# EAGLE design ENC_1_1 (EAGLE 7.6.0)
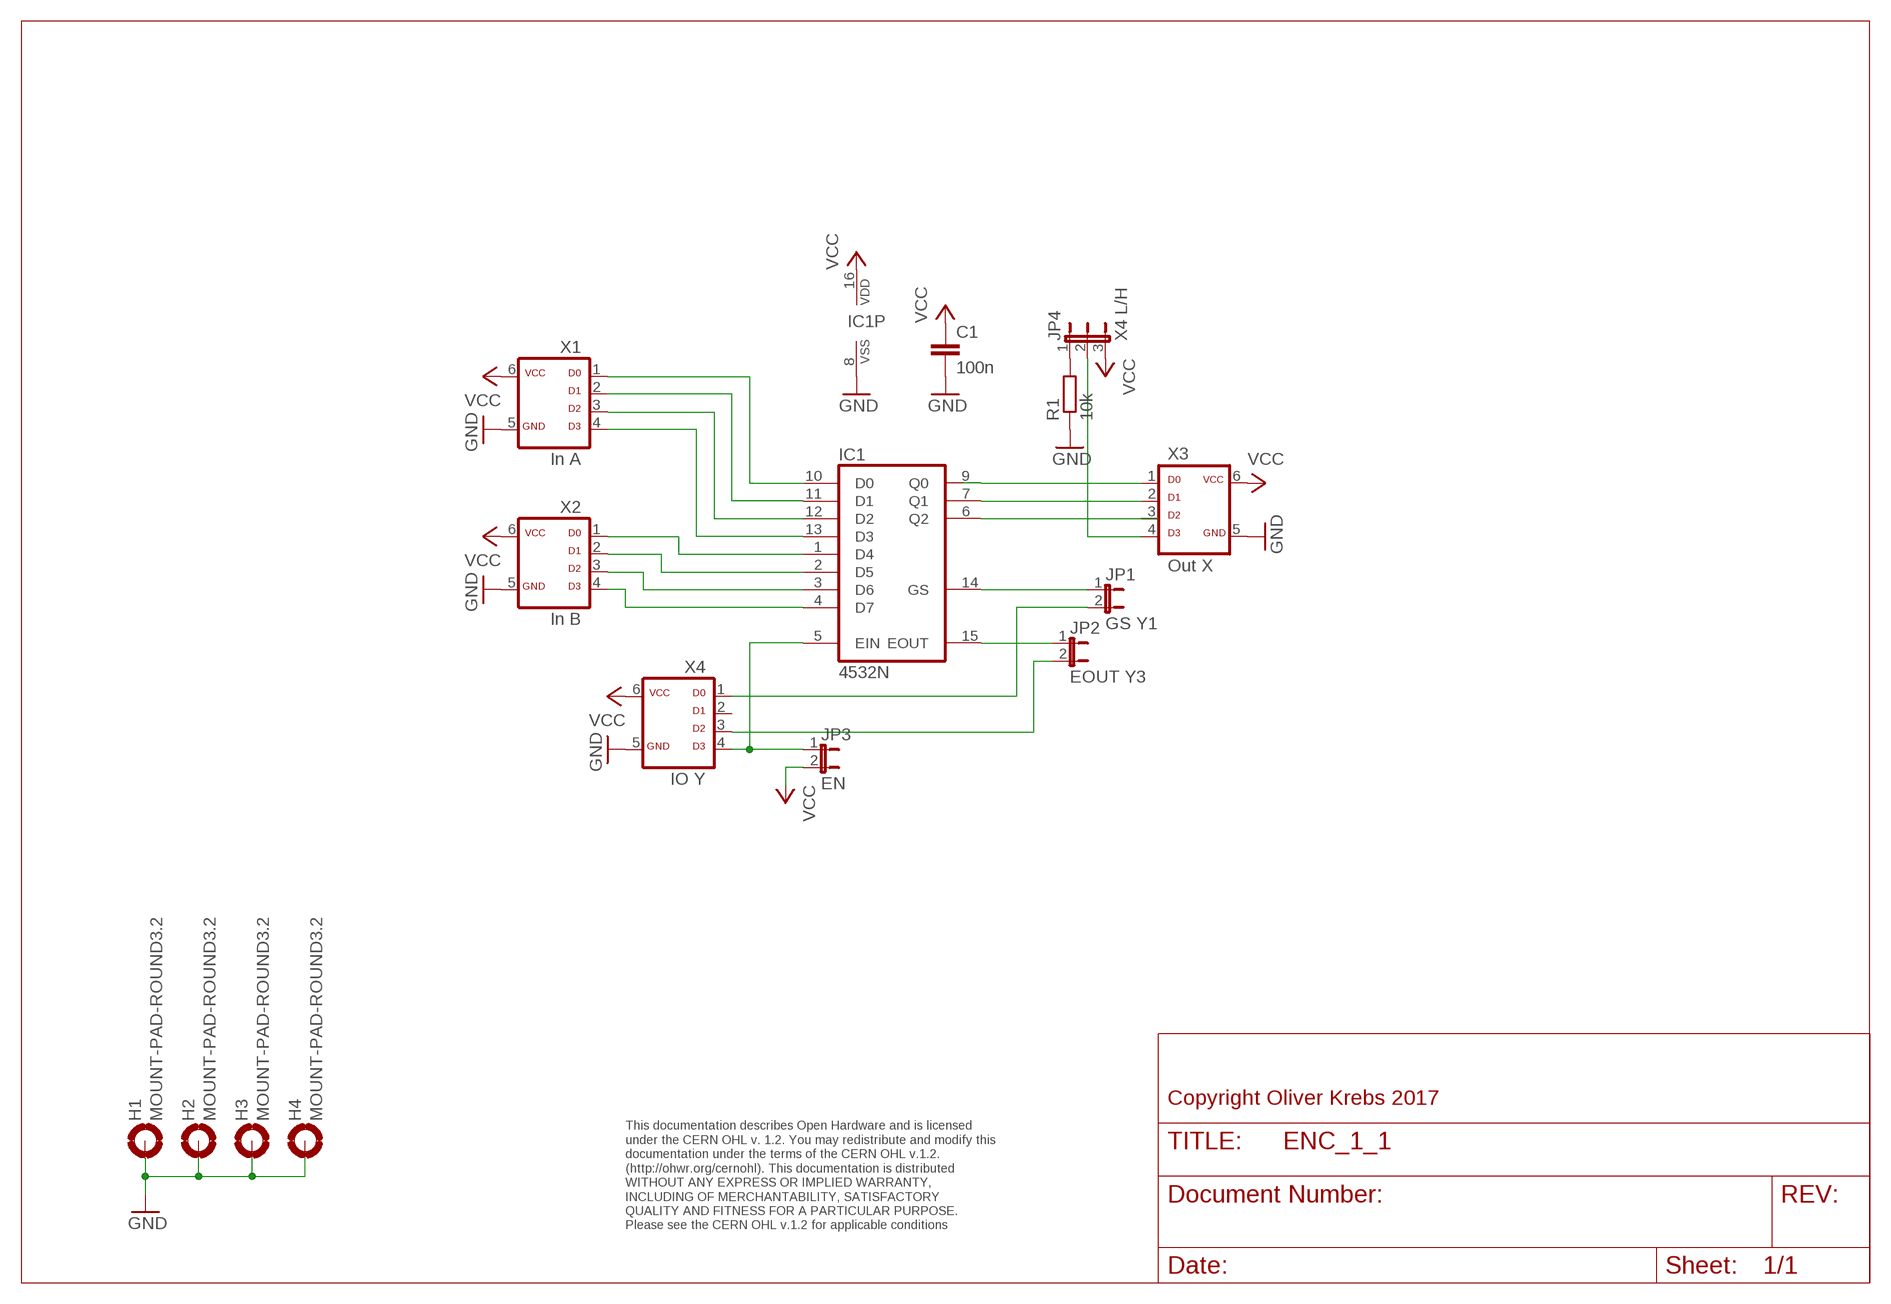
[diagram p0: schematic, sheet 1]

## Parts
C1  100n  C-EU050-025X075  [C050-025X075]
H1  MOUNT-PAD-ROUND3.2  [3,2-PAD]
H2  MOUNT-PAD-ROUND3.2  [3,2-PAD]
H3  MOUNT-PAD-ROUND3.2  [3,2-PAD]
H4  MOUNT-PAD-ROUND3.2  [3,2-PAD]
IC1  4532N  [DIL16]
JP1  GS Y1  JP1E  [JP1]
JP2  EOUT Y3  JP1E  [JP1]
JP3  EN  JP1E  [JP1]
JP4  X4 L/H  JP2EJP2-U  [JP2-U]
R1  10k  R-EU_0207/10  [0207/10]
X1  In A  ML6D  [ML-6]
X2  In B  ML6D  [ML-6]
X3  Out X  ML6D  [ML-6]
X4  IO Y  ML6D  [ML-6]

## Nets
GND: C1.2 H1.B3,2(MOUNT) H2.B3,2(MOUNT) H3.B3,2(MOUNT) H4.B3,2(MOUNT) IC1.8(VSS) R1.1 X1.5 X2.5 X3.5 X4.5
N$1: IC1.9(Q0) X3.1
N$2: IC1.7(Q1) X3.2
N$3: IC1.6(Q2) X3.3
N$4: IC1.1(D4) X2.1
N$5: IC1.2(D5) X2.2
N$6: IC1.3(D6) X2.3
N$7: IC1.4(D7) X2.4
N$8: IC1.13(D3) X1.4
N$9: IC1.12(D2) X1.3
N$10: IC1.11(D1) X1.2
N$11: IC1.10(D0) X1.1
N$12: IC1.5(EIN) JP3.1 X4.4
N$13: IC1.14(GS) JP1.1
N$14: JP1.2 X4.1
N$15: JP2.2 X4.3
N$16: IC1.15(EOUT) JP2.1
N$17: JP4.2 X3.4
N$20: JP4.1 R1.2
VCC: C1.1 IC1.16(VDD) JP3.2 JP4.3 X1.6 X2.6 X3.6 X4.6
Unconnected: X4.2

## Notes on the sheet
- Copyright Oliver Krebs 2017
- This documentation describes Open Hardware and is licensed 
  under the CERN OHL v. 1.2. You may redistribute and modify this 
  documentation under the terms of the CERN OHL v.1.2. 
  (http://ohwr.org/cernohl). This documentation is distributed
  WITHOUT ANY EXPRESS OR IMPLIED WARRANTY, 
  INCLUDING OF MERCHANTABILITY, SATISFACTORY 
  QUALITY AND FITNESS FOR A PARTICULAR PURPOSE. 
  Please see the CERN OHL v.1.2 for applicable conditions

## Library data of the parts
C1 = 01-my_rcl:C-EU: CAPACITOR, European symbol
H1-H4 = holes:MOUNT-PAD-ROUND: MOUNTING PAD, round
IC1 = 45xx:4532: 8-bit PRIORITY ENCODER
JP1-JP3 = jumper:JP1E: JUMPER
JP4 = 01-my-jumper:JP2E: JUMPER
R1 = 01-my_rcl:R-EU_: RESISTOR, European symbol
X1-X4 = 01-my-con:ML6D

## Board
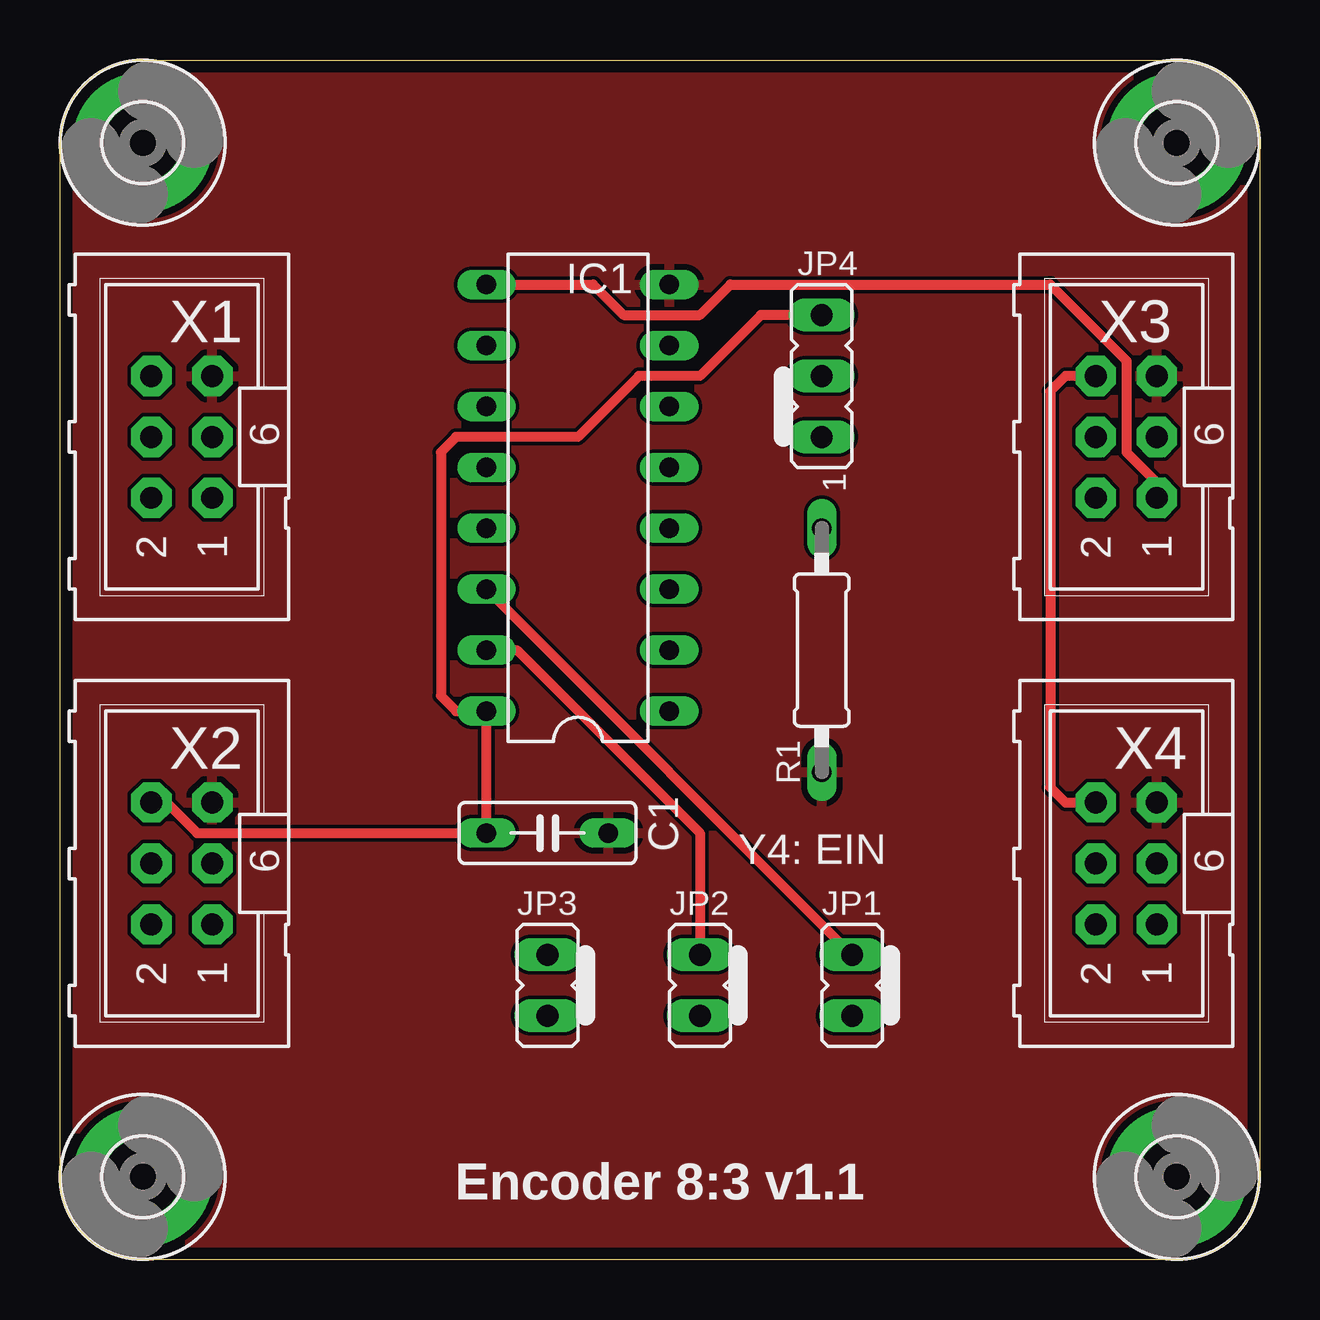
[diagram p1: board, top side]
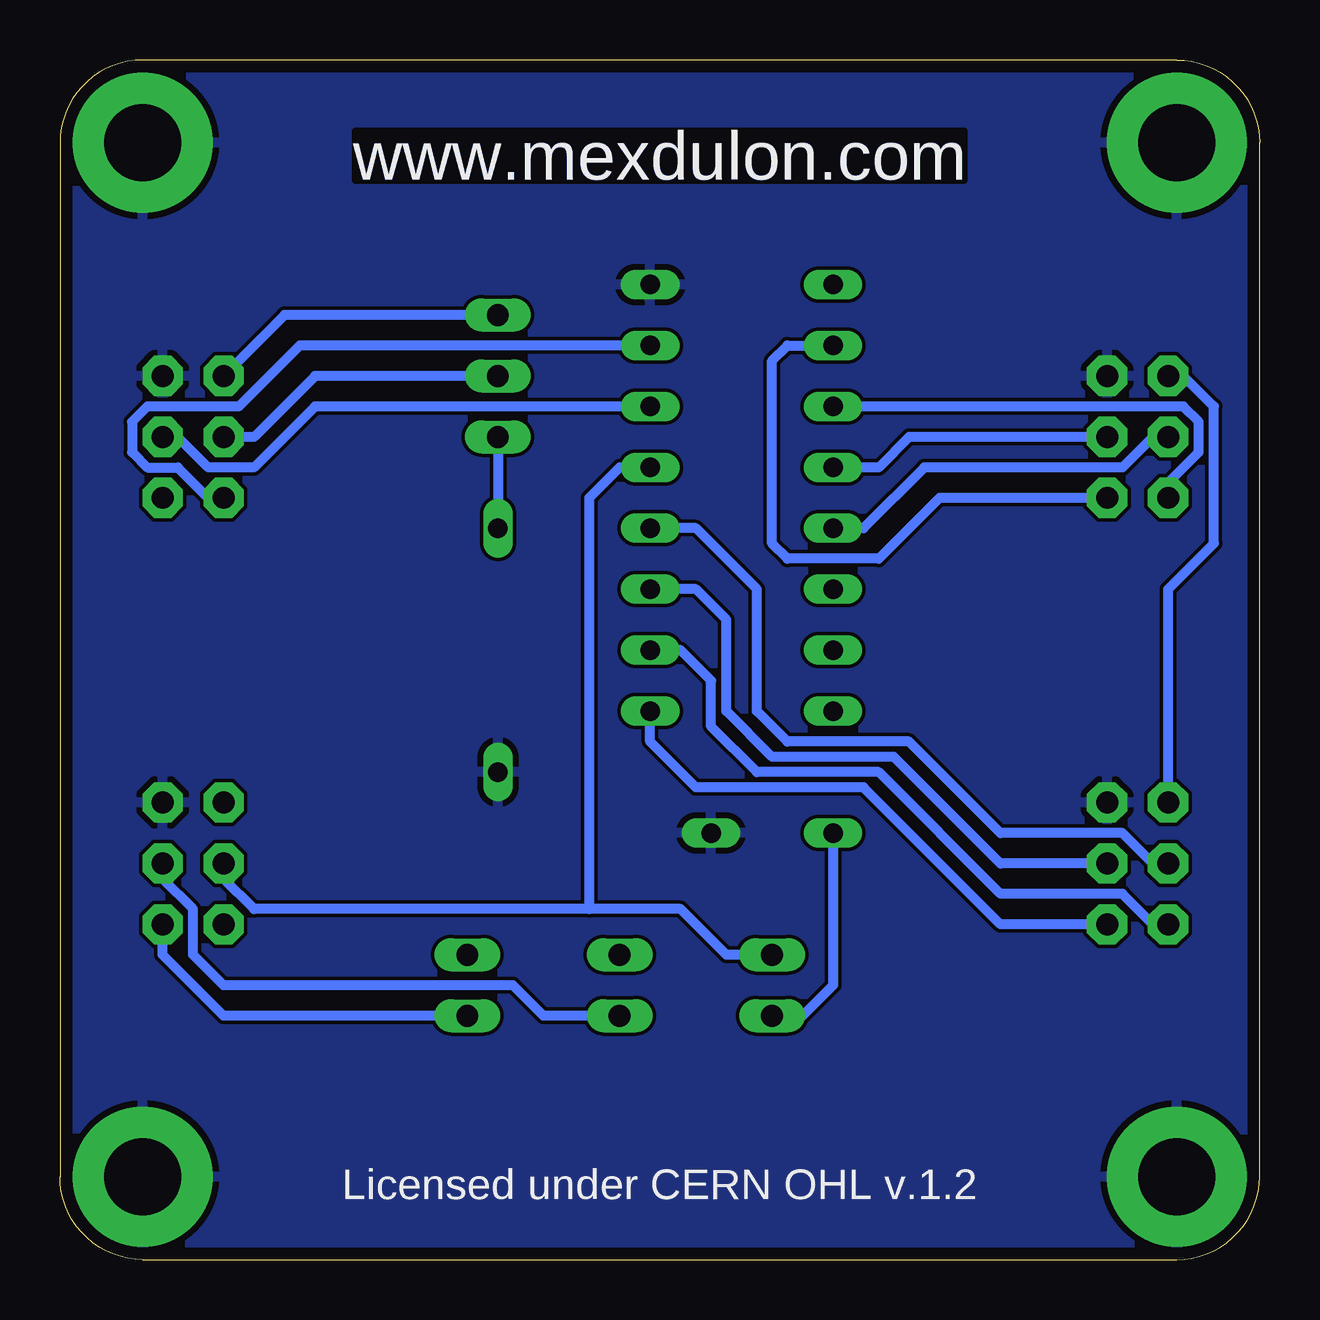
[diagram p2: board, bottom side, seen from below]

Size 50 x 50 mm. Coordinates in mm from the lower left corner, seen from the top.
Outline: 0,3.45 0,46.55 arc-90 3.45,50 46.55,50 arc-90 50,46.55 50,3.45 arc-90 46.55,0 3.45,0 arc-90 0,3.45
Copper layers (1*16): Top 0.035mm / dielectric 1.6mm / Bottom 0.035mm
Design rules "Elecrow_2-layer_PCB_eagle_rule": minimum track width 6mil, minimum drill 12mil, track to track 6mil, track to pad 6mil, pad to pad 6mil, via to via 8mil, smd to smd 0mil, copper to edge 20mil, drill to drill 10mil, minimum pad ring 6mil, minimum via ring 6mil, stop-mask expansion 0mil, vias tented up to drill 100mil, thermal gap 10mil

### Footprints (pad centres in the part's own frame; a part is rotated, then mirrored left to right if it is on the bottom)
C050-025X075 = drill 0.813 long: 1 -2.54,0; 2 2.54,0
3,2-PAD = drill 3.2 pad 5.842: B3,2 0,0
DIL16 = drill 0.813 long: 1 -8.89,-3.81; 2 -6.35,-3.81; 3 -3.81,-3.81; 4 -1.27,-3.81; 5 1.27,-3.81; 6 3.81,-3.81; 7 6.35,-3.81; 8 8.89,-3.81; 9 8.89,3.81; 10 6.35,3.81; 11 3.81,3.81; 12 1.27,3.81; 13 -1.27,3.81; 14 -3.81,3.81; 15 -6.35,3.81; 16 -8.89,3.81
JP1 = drill 0.914 long: 1 0,-1.27; 2 0,1.27
JP2-U = drill 0.914 long: 1 -2.54,0; 2 0,0; 3 2.54,0
0207/10 = drill 0.813 long: 1 -5.08,0; 2 5.08,0
ML-6 = drill 0.914 pad 1.676 octagon: 1 -2.54,-1.27; 2 -2.54,1.27; 3 0,-1.27; 4 0,1.27; 5 2.54,-1.27; 6 2.54,1.27

### Placement (x,y rotation side)
C1  20.32,17.78 0 top
H1  3.45,46.55 0 top
H2  46.55,3.45 0 top
H3  46.55,46.55 0 top
H4  3.45,3.45 0 top
IC1  21.59,31.75 90 top
JP1  33.02,11.43 180 top
JP2  26.67,11.43 180 top
JP3  20.32,11.43 180 top
JP4  31.75,36.83 90 top
R1  31.75,25.4 90 top
X1  5.08,34.29 90 top
X2  5.08,16.51 90 top
X3  44.45,34.29 90 top
X4  44.45,16.51 90 top

### Tracks (layer width: path | path; a pad name or v marks a point on that pad's centre or on a via)
GND
  pour Top: 0,50.16 50.16,50.16 50.16,0 0,0
  pour Bottom: 0,50.16 50.16,50.16 50.16,0 0,0
N$1
  Top 0.406: IC1.9 22.23,40.64 23.5,39.37 26.67,39.37 27.94,40.64 41.27,40.64 44.45,37.47 44.45,33.66 45.72,32.38 X3.1
N$2
  Bottom 0.406: IC1.7 40.01,38.1 42.55,35.56 46.35,35.56 46.99,34.92 46.99,33.66 46.35,33.02 45.09,33.02 43.81,31.75 X3.2
N$3
  Bottom 0.406: IC1.6 39.37,35.56 41.91,33.02 43.81,33.02 45.09,34.29 X3.3
N$4
  Bottom 0.406: X2.1 10.79,13.97 16.51,19.68 23.5,19.68 25.4,21.59 IC1.1
N$5
  Bottom 0.406: X2.2 4.45,13.97 5.71,15.24 10.79,15.24 15.88,20.32 20.95,20.32 22.86,22.23 22.86,24.13 24.13,25.4 IC1.2
N$6
  Bottom 0.406: X2.3 10.79,16.51 15.24,20.95 20.32,20.95 22.23,22.86 22.23,26.67 23.5,27.94 IC1.3
N$7
  Bottom 0.406: X2.4 4.45,16.51 5.71,17.78 10.79,17.78 14.61,21.59 19.68,21.59 20.95,22.86 20.95,27.94 23.5,30.48 IC1.4
N$8
  Bottom 0.406: X1.4 4.45,34.29 5.71,33.02 13.97,33.02 16.51,30.48 IC1.13
N$9
  Bottom 0.406: X1.3 14.61,34.29 15.88,33.02 IC1.12
N$10
  Bottom 0.406: X1.2 3.81,32.38 2.54,33.66 2.54,34.92 3.17,35.56 IC1.11
N$11
  Bottom 0.406: X1.1 13.34,31.75 15.88,29.21 19.68,29.21 20.32,29.84 20.32,37.47 19.68,38.1 IC1.10
N$12
  Bottom 0.406: JP3.1 22.23,12.7 24.13,14.61 27.94,14.61 | 27.94,14.61 41.91,14.61 43.18,15.88 X4.4 | IC1.5 26.67,33.02 27.94,31.75 27.94,14.61
N$13
  Top 0.406: IC1.14 JP1.1
N$14
  Bottom 0.406: JP1.2 43.18,10.16 45.72,12.7 X4.1
N$15
  Bottom 0.406: JP2.2 29.84,10.16 31.11,11.43 43.18,11.43 44.45,12.7 44.45,14.61 45.72,15.88 X4.3
N$16
  Top 0.406: IC1.15 19.05,25.4 26.67,17.78 JP2.1
N$17
  Bottom 0.406: JP4.2 39.37,36.83 41.91,34.29 X3.4
N$20
  Bottom 0.406: JP4.1 R1.2
VCC
  Top 0.406: JP4.3 29.21,39.37 26.67,36.83 24.13,36.83 21.59,34.29 16.51,34.29 15.88,33.66 15.88,23.5 16.51,22.86 IC1.16 C1.1 5.71,17.78 4.45,19.05 X2.6 | X3.6 41.91,36.83 41.27,36.2 41.27,19.68 41.91,19.05 X4.6
  Bottom 0.406: JP4.3 40.64,39.37 X3.6 | X2.6 3.81,27.94 1.91,29.84 1.91,35.56 3.17,36.83 X1.6 | C1.1 17.78,11.43 19.05,10.16 JP3.2

### Text on the board
Bottom: www.mexdulon.com
tNames: Y4: EIN | Encoder 8:3 v1.1
bNames: www.mexdulon.com | Licensed under CERN OHL v.1.2
200bmp: E:/Bilder/Elektronik/Modulion/Mexdulon/mexdulon_50x50_pcb.bmp